# EAGLE design OpenSprinkler_v14_smt (EAGLE 6.2)
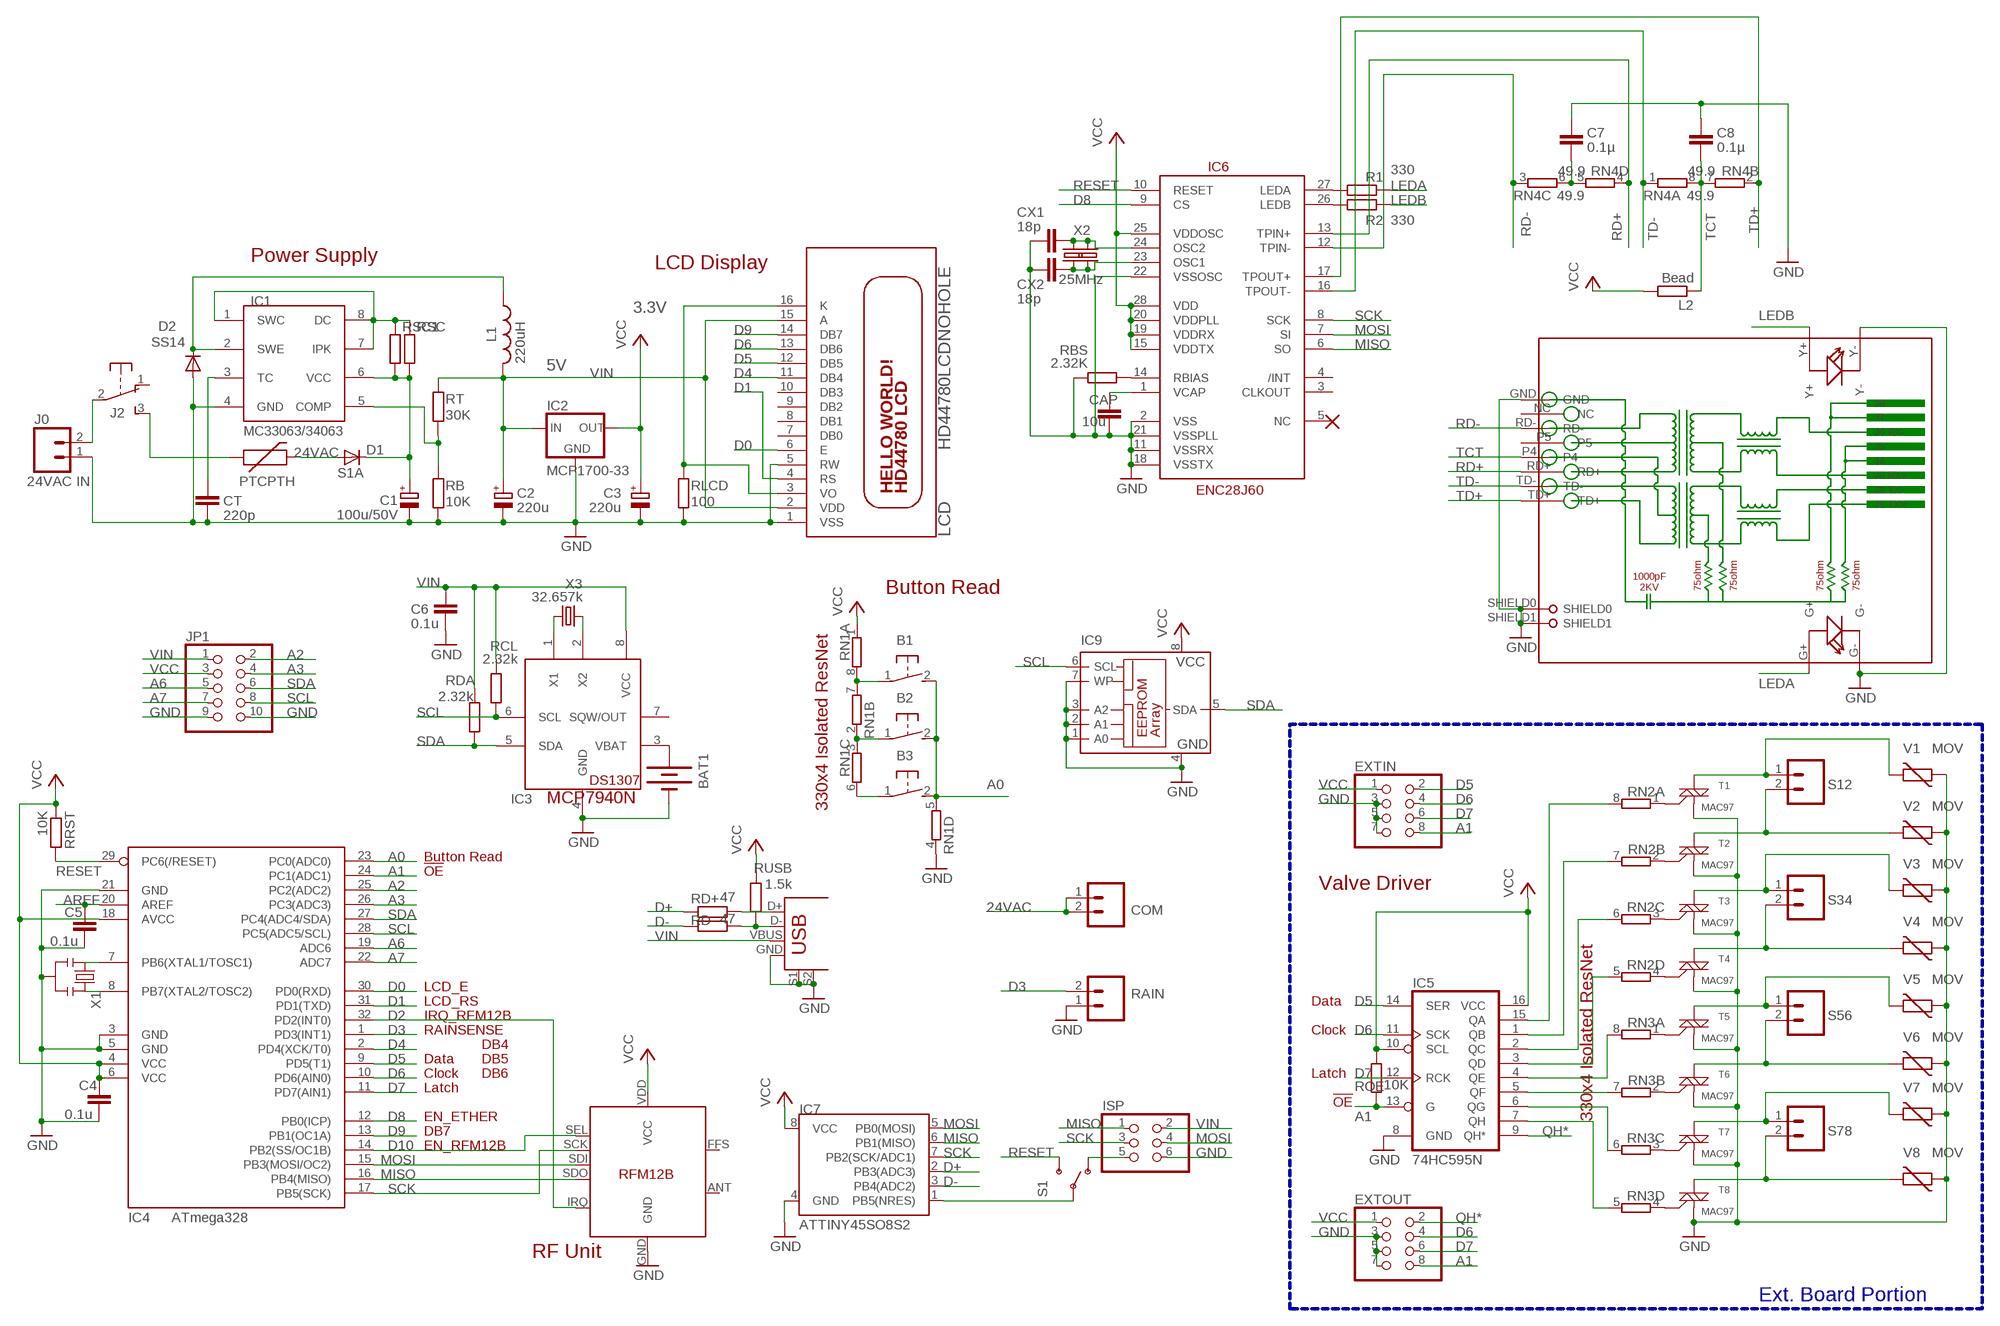
[diagram p0: schematic, sheet 1]

## Parts
B1  31-XX  [B3F-31XX]
B2  31-XX  [B3F-31XX]
B3  31-XX  [B3F-31XX]
BAT1  BATTERY12PTH  [BATTCON_12MM_PTH]
C1  100u/50V  CPOL-EUE3.5-8  [E3,5-8]
C2  220u  CPOL-EUE2-5  [E2-5]
C3  220u  CPOL-EUE2-5  [E2-5]
C4  0.1u  C-EUC0805  [C0805]
C5  0.1u  C-EUC0805  [C0805]
C6  0.1u  C-EUC0805  [C0805]
C7  0.1µ  C-EUC0805  [C0805]
C8  0.1µ  C-EUC0805  [C0805]
CAP  10u  C-EUC0805  [C0805]
COM  M025MM  [SCREWTERMINAL-5MM-2]
CT  220p  C-EUC0805  [C0805]
CX1  18p  C-EUC0805  [C0805]
CX2  18p  C-EUC0805  [C0805]
D1  S1A  DIODE-DO214AC  [DO214AC]
D2  SS14  DIODE-DO214AC  [DO214AC]
EXTIN  PINHD-2X4  [2X04]
EXTOUT  PINHD-2X4  [2X04]
IC1  MC33063/MC34063D  [SO08]
IC2  MCP1700-33  MCP1700SOT233  [SOT23]
IC3  MCP7940N  DS1307SOIC  [SO08]
IC4  ATmega328  MEGA8-AI  [TQFP32-08]
IC5  74HC595N  74LS595D  [SO16]
IC6  ENC28J60  ENC28J60SO28LONG  [SOIC28WLONG]
IC7  ATTINY45SO8S2  [SO8S2]
IC8  RFM12B  [RFM12B]
IC9  24AA128SN  [SO-08]
ISP  PINHD-2X3  [2X03]
J0  24VAC IN  M025MM  [SCREWTERMINAL-5MM-2]
J2  EG1206  [EG1206]
JP1  PINHD-2X5  [2X05]
L1  220uH  L-US6000-XXX-RC  [6000-XXXX-RC]
L2  Bead  R-EU_R0805  [R0805]
LCD  HD44780LCDNOHOLE  [LCD1602A]
PTC  PTCPTH  [PTC]
R1  330  R-EU_R0805  [R0805]
R2  330  R-EU_R0805  [R0805]
RAIN  M025MM  [SCREWTERMINAL-5MM-2]
RB  10K  R-EU_R0805  [R0805]
RBS  2.32K  R-EU_R0805  [R0805]
RCL  2.32k  R-EU_R0805  [R0805]
RD+  47  R-EU_R0805  [R0805]
RD-  47  R-EU_R0805  [R0805]
RDA  2.32k  R-EU_R0805  [R0805]
RJ1  HR911105A  [HR911105A]
RLCD  100  R-EU_R0805  [R0805]
RN1  4R-NEXBV8V  [EXBV8V]
RN2  4R-NEXBV8V  [EXBV8V]
RN3  4R-NEXBV8V  [EXBV8V]
RN4  49.9  4R-NEXBV8V  [EXBV8V]
ROE  10K  R-EU_R0805  [R0805]
RRST  10K  R-EU_R0805  [R0805]
RSC  1.0  R-EU_R0805  [R0805]
RSC1  1.0  R-EU_R0805  [R0805]
RT  30K  R-EU_R0805  [R0805]
RUSB  1.5k  R-EU_R0805  [R0805]
S1  SWITCH-SPSTSMD2  [SWITCH-SPDT-SMD]
S12  M025MM  [SCREWTERMINAL-5MM-2]
S34  M025MM  [SCREWTERMINAL-5MM-2]
S56  M025MM  [SCREWTERMINAL-5MM-2]
S78  M025MM  [SCREWTERMINAL-5MM-2]
T1  MAC97  MAC97SOT223  [SOT223]
T2  MAC97  MAC97SOT223  [SOT223]
T3  MAC97  MAC97SOT223  [SOT223]
T4  MAC97  MAC97SOT223  [SOT223]
T5  MAC97  MAC97SOT223  [SOT223]
T6  MAC97  MAC97SOT223  [SOT223]
T7  MAC97  MAC97SOT223  [SOT223]
T8  MAC97  MAC97SOT223  [SOT223]
USB  USB+SHIELD  [USB-B-PTH]
V1  MOV  VARISTOR-5  [R-5]
V2  MOV  VARISTOR-5  [R-5]
V3  MOV  VARISTOR-5  [R-5]
V4  MOV  VARISTOR-5  [R-5]
V5  MOV  VARISTOR-5  [R-5]
V6  MOV  VARISTOR-5  [R-5]
V7  MOV  VARISTOR-5  [R-5]
V8  MOV  VARISTOR-5  [R-5]
X1  RESONATORSMD  [RESONATOR-SMD]
X2  25MHz  CRYSTALSMD  [HC49UP]
X2A  25MHz  CRYSTALHC49US  [HC49US]
X3  32.657k  CRYSTALTC26H  [TC26H]

## Nets
24VAC [power]: COM.1 COM.2 D1.A PTC.P$2
A0: B1.2(S) B2.2(S) B3.2(S) IC4.23(PC0(ADC0)) RN1.5
A1: EXTIN.8 EXTOUT.8 IC4.24(PC1(ADC1)) IC5.13(G) ROE.1
A2: IC4.25(PC2(ADC2)) JP1.2
A3: IC4.26(PC3(ADC3)) JP1.4
A6: IC4.19(ADC6) JP1.5
A7: IC4.22(ADC7) JP1.7
AREF: C5.1 IC4.20(AREF)
D0: IC4.30(PD0(RXD)) LCD.6(E)
D1: IC4.31(PD1(TXD)) LCD.4(RS)
D2: IC4.32(PD2(INT0)) IC8.IRQ
D3: IC4.1(PD3(INT1)) RAIN.2
D4: IC4.2(PD4(XCK/T0)) LCD.11(DB4)
D5: EXTIN.2 IC4.9(PD5(T1)) IC5.14(SER) LCD.12(DB5)
D6: EXTIN.4 EXTOUT.4 IC4.10(PD6(AIN0)) IC5.11(SCK) LCD.13(DB6)
D7: EXTIN.6 EXTOUT.6 IC4.11(PD7(AIN1)) IC5.12(RCK)
D8: IC4.12(PB0(ICP)) IC6.9(CS)
D9: IC4.13(PB1(OC1A)) LCD.14(DB7)
D10: IC4.14(PB2(SS/OC1B)) IC8.SEL
D+: IC7.2(PB3(ADC3)) RD+.1
D-: IC7.3(PB4(ADC2)) RD-.1
GND: BAT1.GND(-) C1.- C2.- C3.- C4.2 C5.2 C6.2 C7.1 C8.1 CAP.2 CT.2 CX1.2 CX2.2 D2.A EXTIN.3 EXTIN.5 EXTIN.7 EXTOUT.3 EXTOUT.5 EXTOUT.7 IC1.4(GND) IC2.1(GND) IC3.4(GND) IC4.3(GND) IC4.5(GND) IC4.21(GND) IC5.8(GND) IC6.2(VSS) IC6.11(VSSRX) IC6.18(VSSTX) IC6.21(VSSPLL) IC6.22(VSSOSC) IC7.4(GND) IC8.GND IC9.1(A0) IC9.2(A1) IC9.3(A2) IC9.4(GND) IC9.7(WP) ISP.6 J0.1 JP1.9 JP1.10 LCD.1(VSS) LCD.5(RW) RAIN.1 RB.2 RBS.1 RJ1.G- RJ1.GND RJ1.SHIELD0 RJ1.SHIELD1 RJ1.Y- RLCD.2 RN1.4 T1.1(M1) T2.1(M1) T3.1(M1) T4.1(M1) T5.1(M1) T6.1(M1) T7.1(M1) T8.1(M1) USB.GND USB.S1 USB.S2 V1.1 V2.1 V3.1 V4.1 V5.1 V6.1 V7.1 V8.1 X1.2
LEDA: R1.2 RJ1.G+
LEDB: R2.2 RJ1.Y+
MISO: IC4.16(PB4(MISO)) IC6.6(SO) IC7.6(PB1(MISO)) IC8.SDO ISP.1
MOSI: IC4.15(PB3(MOSI/OC2)) IC6.7(SI) IC7.5(PB0(MOSI)) IC8.SDI ISP.4
N$2: IC4.8(PB7(XTAL2/TOSC2)) X1.3
N$3: RN2.1 T1.3(G)
N$4: IC5.5(QF) RN3.7
N$5: IC5.6(QG) RN3.6
N$6 [power]: J0.2 J2.2(P)
N$7: IC5.7(QH) RN3.5
N$8: IC4.7(PB6(XTAL1/TOSC1)) X1.1
N$9 [power]: C1.+ D1.C IC1.6(VCC) RSC1.2 RSC.2
N$10: IC5.4(QE) RN3.8
N$11: IC5.3(QD) RN2.5
N$12: IC5.2(QC) RN2.6
N$13: IC5.1(QB) RN2.7
N$14: IC5.15(QA) RN2.8
N$15: RN2.2 T2.3(G)
N$16 [power]: S12.1 T1.4(M2) V1.2
N$17 [power]: S12.2 T2.4(M2) V2.2
N$18 [power]: S34.1 T3.4(M2) V3.2
N$19: RN2.3 T3.3(G)
N$20 [power]: S34.2 T4.4(M2) V4.2
N$21: RN2.4 T4.3(G)
N$22 [power]: S56.1 T5.4(M2) V5.2
N$23 [power]: S56.2 T6.4(M2) V6.2
N$24 [power]: S78.1 T7.4(M2) V7.2
N$25 [power]: S78.2 T8.4(M2) V8.2
N$26: RN3.1 T5.3(G)
N$27: RN3.2 T6.3(G)
N$28: RN3.3 T7.3(G)
N$29: RN3.4 T8.3(G)
N$30: ISP.5 S1.1(O)
N$31 [power]: J2.3(S) PTC.P$1
N$32: B1.1(P) RN1.7 RN1.8
N$33: B3.1(P) RN1.6
N$34: IC6.27(LEDA) R1.1
N$35: B2.1(P) RN1.2 RN1.3
N$36: BAT1.VCC@1(+) IC3.3(VBAT)
N$37: IC6.26(LEDB) R2.1
N$38: RD+.2 USB.D+
N$39: CAP.1 IC6.1(VCAP)
N$40 [power]: IC1.1(SWC) IC1.7(IPK) IC1.8(DC) RSC1.1 RSC.1
N$41: CX1.1 IC6.24(OSC2) X2.1 X2A.2
N$42: CX2.1 IC6.23(OSC1) X2.2 X2A.1
N$45: RD-.2 RUSB.1 USB.D-
N$46 [power]: D2.C IC1.2(SWE) L1.1
N$47: IC3.1(X1) X3.1
N$49: CT.1 IC1.3(TC)
N$50: IC3.2(X2) X3.2
N$52: IC7.1(PB5(NRES)) S1.2(P)
N$54: C7.2 RN4.5 RN4.6
N$55: IC1.5(COMP) RB.1 RT.2
N$56: LCD.3(VO) LCD.16(K) RLCD.1
N$59: IC6.14(RBIAS) RBS.2
QH*: EXTOUT.2 IC5.9(QH*)
RD+: IC6.13(TPIN+) RJ1.RD+ RN4.4
RD-: IC6.12(TPIN-) RJ1.RD- RN4.3
RESET: IC4.29(PC6(/RESET)) IC6.10(RESET) RRST.2 S1.3(S)
SCK: IC4.17(PB5(SCK)) IC6.8(SCK) IC7.7(PB2(SCK/ADC1)) IC8.SCK ISP.3
SCL: IC3.6(SCL) IC4.28(PC5(ADC5/SCL)) IC9.6(SCL) JP1.8 RCL.2
SDA: IC3.5(SDA) IC4.27(PC4(ADC4/SDA)) IC9.5(SDA) JP1.6 RDA.2
TCT: C8.2 L2.1 RJ1.P4 RN4.7 RN4.8
TD+: IC6.17(TPOUT+) RJ1.TD+ RN4.2
TD-: IC6.16(TPOUT-) RJ1.TD- RN4.1
VCC: C3.+ C4.1 EXTIN.1 EXTOUT.1 IC2.2(OUT) IC4.4(VCC) IC4.6(VCC) IC4.18(AVCC) IC5.10(SCL) IC5.16(VCC) IC6.15(VDDTX) IC6.19(VDDRX) IC6.20(VDDPLL) IC6.25(VDDOSC) IC6.28(VDD) IC7.8(VCC) IC8.VDD(VCC) IC9.8(VCC) JP1.3 L2.2 RN1.1 ROE.2 RRST.1 RUSB.2
VIN: C2.+ C6.1 IC2.3(IN) IC3.8(VCC) ISP.2 JP1.1 L1.2 LCD.2(VDD) LCD.15(A) RCL.1 RDA.1 RT.1 USB.VBUS
Unconnected: IC3.7(SQW/OUT) IC6.3(CLKOUT) IC6.4(/INT) IC6.5(NC) IC8.ANT IC8.FFS J2.1(O) LCD.7(DB0) LCD.8(DB1) LCD.9(DB2) LCD.10(DB3) RJ1.NC RJ1.P5

## Buses
B$1

## Notes on the sheet
- Power Supply
- LCD Display
- 3.3V
- 5V
- Button Read
- MCP7940N
- 330x4 Isolated ResNet
- Button Read
- !OE
- Valve Driver
- LCD_E
- LCD_RS | Data
- IRQ_RFM12B
- RAINSENSE | Clock
- DB4
- Data | DB5
- Clock | DB6 | Latch
- Latch
- !OE
- EN_ETHER | 330x4 Isolated ResNet
- DB7
- EN_RFM12B
- RF Unit
- Ext. Board Portion

## Library data of the parts
B1-B3 = adafruit:31-XX: OMRON SWITCH Now with beefier pads!
BAT1 = SparkFun:BATTERY: Battery Holders Various common sizes : AA, AAA, 20mm coin cell and 12mm coin cell.
C1-C3 = resistor:CPOL-EU: POLARIZED CAPACITOR, European symbol
C4-C6 CT = rcl:C-EU: CAPACITOR, European symbol
C7 C8 CAP CX1 CX2 = resistor:C-EU: CAPACITOR, European symbol
COM J0 RAIN S12 S34 S56 S78 = SparkFun:M02: Header 2 Standard 2-pin 0.1" header. Use with straight break away headers (SKU : PRT-00116), right angle break away headers (PRT-00553), swiss pins (PRT-00743), machine pins (PRT-00117), and female headers (PRT-00115). Molex polarized connector foot print use with SKU : PRT-08233 with associated crimp pins and housings.
D1 D2 = diode:DIODE-: DIODE
EXTIN EXTOUT = pinhead:PINHD-2X4: PIN HEADER
IC1 = adafruit:MC33063/MC34063: MC33063 and MC34063 Basic DC/DC converter with internal power-NPN transistor, 100KHz, 1.5A peak switch current. 3-40 input/output.
IC2 = adafruit:MCP1700: VOLTAGE REGULATOR
IC3 = adafruit:DS1307: DS1307 Real time clock (RTC) with battery backup ability. Talk to it via i2c
IC4 = atmel:MEGA8: MICROCONTROLLER 8 Kbytes FLASH, 1 kbytes SRAM, 512 bytes EEPROM, USART, 6-channel 10 bit ADC, 2-channel 8 bit ADC Pin compatible with Atmega48, ATMega88, ATMega168 Source: avr.lbr; MPN: ATMEGA8-16AU; OC_FARNELL: 9171371; OC_NEWARK: 73M8863
IC5 = SparkFun:74*595: 8-bit SHIFT REGISTER, output latch
IC6 = SparkFun:ENC28J60
IC7 = SparkFun:ATTINY45: Atmel ATTiny45
IC8 = JeeLabs:RFM12B
IC9 = microchip-6:24*: Serial EEPROM I2C
ISP = pinhead:PINHD-2X3: PIN HEADER
J2 = adafruit:EG1206
JP1 = pinhead:PINHD-2X5: PIN HEADER
L1 = rcl:L-US: INDUCTOR, American symbol
L2 R1 R2 RB RBS RCL RD+ RD- RDA RLCD ROE RRST RSC RSC1 RT RUSB = rcl:R-EU_: RESISTOR, European symbol
LCD = adafruit:HD44780LCD: HD44780 LCD Standard character type LCDs, available in sizes from 8x1 to 40x4!
PTC = SparkFunNew:PTC: Resettable Fuse PTC Resettable Fuse. Spark Fun Electronics SKU : COM-08357
RJ1 = CONNECTER:HR911105A
RN1-RN4 = resistor-dil:4R-N: Array Chip Resistor Source: RS Component / Phycomp; OC_FARNELL: unknown; OC_NEWARK: unknown
S1 = SparkFun:SWITCH-SPST: SPST Switch Simple slide switch. Spark Fun Electronics SKU : COM-00102
T1-T8 = SparkFun:MAC97: MAC97 Triac http://www.onsemi.com/pub_link/Collateral/MAC97-D.PDF
USB = SparkFunNew:USB+SHIELD: USB+Shield USB connector with shield pins connectable
V1-V8 = varistor:VARISTOR: VARISTOR
X1 = SparkFun:RESONATOR: Resonator Small SMD resonator. This is the itty bitty 10/20MHz resonators with built in caps. CSTCE10M0G55 and CSTCE20M0V53. Footprint has been reviewed closely but hasn't been tested yet.
X2 X2A = SparkFun:CRYSTAL: Crystals Various standard crystals. Proven footprints. Spark Fun Electronics SKU : COM-00534
X3 = crystal:CRYSTAL: CRYSTAL; OC_FARNELL: unknown; OC_NEWARK: unknown

## Net classes
0 default: width 0.305 mm, clearance 0.203 mm
1 power: width 0.813 mm, clearance 0.203 mm

## Board
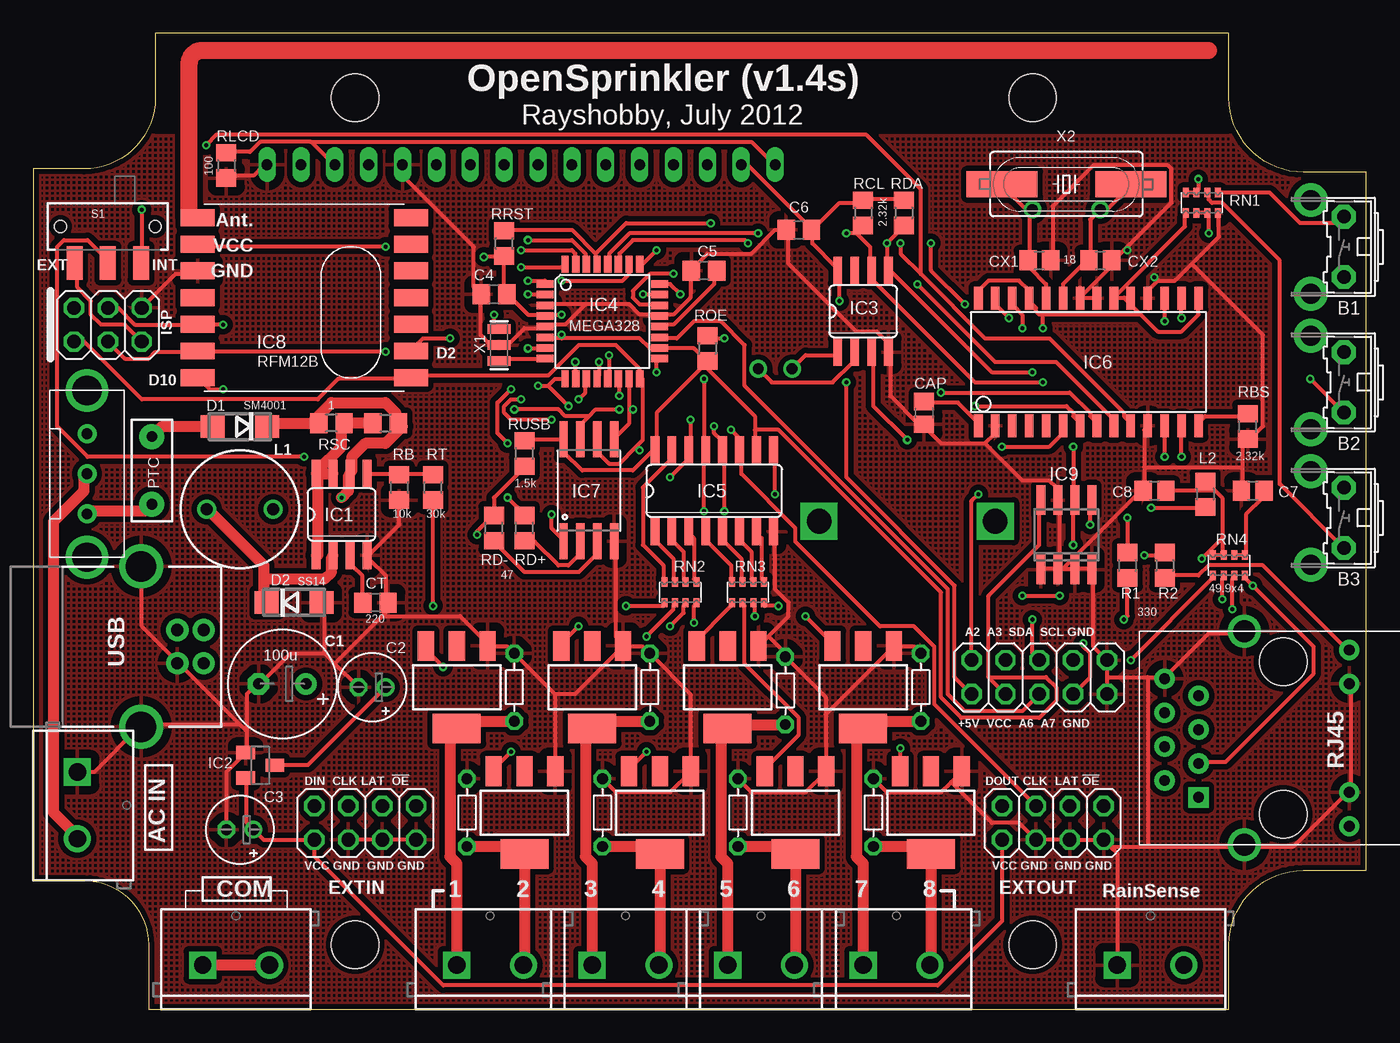
[diagram p1: board, top side]
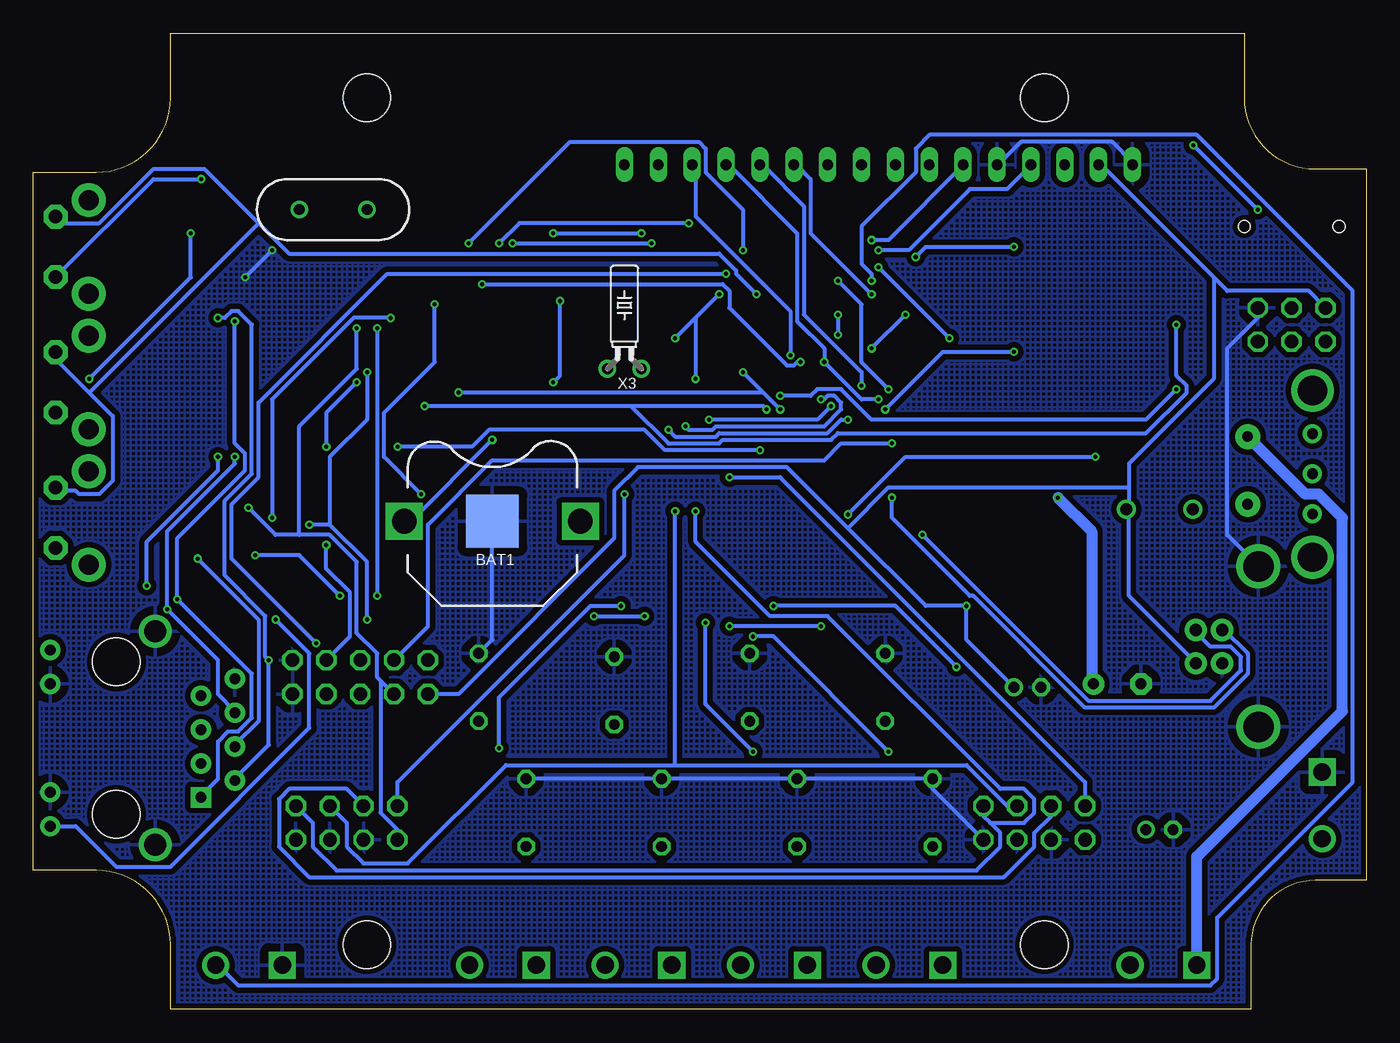
[diagram p2: board, bottom side, seen from below]

Size 99.95 x 73.15 mm. Coordinates in mm from the lower left corner, seen from the top.
Outline: 8.64,0 89.66,0 89.66,4.83 arc-90 95.25,10.41 99.95,10.41 99.95,62.74 95.25,62.74 arc-90 89.66,68.33 89.66,73.15 9.14,73.15 9.14,68.33 arc-90 3.81,62.99 0,62.99 0,9.65 3.81,9.65 arc-90 8.64,4.83 8.64,0
Copper layers (1*16): Top 0.035mm / dielectric 1.5mm / Bottom 0.035mm
Design rules: minimum track width 6mil, minimum drill 12mil, track to track 6mil, track to pad 6mil, pad to pad 8mil, via to via 8mil, smd to smd 0mil, copper to edge 10mil, drill to drill 10mil, minimum pad ring 10mil, minimum via ring 6mil, stop-mask expansion 2mil, vias tented up to drill 100mil, thermal gap 25mil
Holes 3.56 mm at 24.13,4.83 74.93,4.83 24.13,68.33 74.93,68.33
tRestrict: area 9.1,66 to 89.7,73.2
bRestrict: area 9.1,66 to 89.9,73.2
vRestrict: area 21.6,2.3 to 26.7,7.4; area 72.4,2.3 to 77.5,7.4; area 71.9,10.4 to 81.3,10.9; area 71.4,16.8 to 80.8,17.3; area 20.3,16.8 to 29.5,17.3; area 20.3,10.4 to 29.5,10.9; area 8.4,46.5 to 10.9,47.8; area 30,48.5 to 31.8,49.8; area 0.3,55.4 to 2,56.4; area 8.9,55.4 to 10.7,56.1; area 9.7,50.5 to 10.4,52.6; area 8.4,12.2 to 10.4,18; 9 more areas

### Footprints (pad centres in the part's own frame; a part is rotated, then mirrored left to right if it is on the bottom)
B3F-31XX = drill 1.016 pad 1.778 octagon: 1 -2.261,-1.245; 2 2.261,-1.245 | drill 1.499 pad 2.54: 3 -3.505,1.245; 4 3.505,1.245
BATTCON_12MM_PTH = smd 3.962 x 3.962: GND 0,0 | drill 1.854 square: VCC@1 -6.604,0; VCC@2 6.604,0
E3,5-8 = drill 0.813 pad 1.6: + -1.778,0 | drill 0.813 pad 1.6 octagon: - 1.778,0
E2-5 = drill 0.813 pad 1.27: + -1.016,0 | drill 0.813 pad 1.27 octagon: - 1.016,0
C0805 = smd 1.3 x 1.5: 1 -0.95,0; 2 0.95,0
C0805' = smd 1.3 x 1.5: 1 -0.85,0; 2 0.85,0
SCREWTERMINAL-5MM-2 = drill 1.3 pad 2.032 square: 1 0,0 | drill 1.3 pad 2.032: 2 5,0
DO214AC = smd 1.8 x 1.7: A 2.05,0; C -2.05,0
2X04 = drill 1.016 octagon: 1 -3.81,-1.27; 2 -3.81,1.27; 3 -1.27,-1.27; 4 -1.27,1.27; 5 1.27,-1.27; 6 1.27,1.27; 7 3.81,-1.27; 8 3.81,1.27
SO08 = smd 0.66 x 2.032: 1 -1.905,-3.073; 2 -0.635,-3.073; 3 0.635,-3.073; 4 1.905,-3.073; 5 1.905,3.073; 6 0.635,3.073; 7 -0.635,3.073; 8 -1.905,3.073
SOT23 = smd 1 x 1.4: 1 -0.95,-1.1; 2 0.95,-1.1; 3 0,1.1
TQFP32-08 = smd 1.27 x 0.559: 1 -4.293,2.8; 2 -4.293,2; 3 -4.293,1.2; 4 -4.293,0.4; 5 -4.293,-0.4; 6 -4.293,-1.2; 7 -4.293,-2; 8 -4.293,-2.8; 17 4.293,-2.8; 18 4.293,-2; 19 4.293,-1.2; 20 4.293,-0.4; 21 4.293,0.4; 22 4.293,1.2; 23 4.293,2; 24 4.293,2.8 | smd 0.559 x 1.27: 9 -2.8,-4.293; 10 -2,-4.293; 11 -1.2,-4.293; 12 -0.4,-4.293; 13 0.4,-4.293; 14 1.2,-4.293; 15 2,-4.293; 16 2.8,-4.293; 25 2.8,4.293; 26 2,4.293; 27 1.2,4.293; 28 0.4,4.293; 29 -0.4,4.293; 30 -1.2,4.293; 31 -2,4.293; 32 -2.8,4.293
SO16 = smd 0.66 x 2.032: 1 -4.445,-3.073; 2 -3.175,-3.073; 3 -1.905,-3.073; 4 -0.635,-3.073; 5 0.635,-3.073; 6 1.905,-3.073; 7 3.175,-3.073; 8 4.445,-3.073; 9 4.445,3.073; 10 3.175,3.073; 11 1.905,3.073; 12 0.635,3.073; 13 -0.635,3.073; 14 -1.905,3.073; 15 -3.175,3.073; 16 -4.445,3.073
SOIC28WLONG = smd 0.65 x 1.7: 1 -8.89,-4.78; 2 -7.62,-4.78; 3 -6.35,-4.78; 4 -5.08,-4.78; 5 -3.81,-4.78; 6 -2.54,-4.78; 7 -1.27,-4.78; 8 0,-4.78; 9 1.27,-4.78; 10 2.54,-4.78; 11 3.81,-4.78; 12 5.08,-4.78; 13 6.35,-4.78; 14 7.62,-4.78; 15 7.62,4.78; 16 6.35,4.78; 17 5.08,4.78; 18 3.81,4.78; 19 2.54,4.78; 20 1.27,4.78; 21 0,4.78; 22 -1.27,4.78; 23 -2.54,4.78; 24 -3.81,4.78; 25 -5.08,4.78; 26 -6.35,4.78; 27 -7.62,4.78; 28 -8.89,4.78
SO8S2 = smd 0.61 x 2.7: 1 -1.905,-3.778; 2 -0.635,-3.778; 3 0.635,-3.778; 4 1.905,-3.778; 5 1.905,3.853; 6 0.635,3.853; 7 -0.635,3.853; 8 -1.905,3.853
RFM12B = smd 2.54 x 1.27: ANT 8,-6; FFS -8,2; GND 8,-2; IRQ -8,4; P$8 -8,0; P$9 -8,-2; P$10 -8,-4; P$12 -8,-6; P$16 8,0; SCK 8,4; SDI 8,2; SDO -8,6; SEL 8,6; VDD 8,-4
SO-08 = smd 0.66 x 2.2: 1 -1.905,-2.6; 2 -0.635,-2.6; 3 0.635,-2.6; 4 1.905,-2.6; 5 1.905,2.6; 6 0.635,2.6; 7 -0.635,2.6; 8 -1.905,2.6
2X03 = drill 1.016 octagon: 1 -2.54,-1.27; 2 -2.54,1.27; 3 0,-1.27; 4 0,1.27; 5 2.54,-1.27; 6 2.54,1.27
EG1206 = drill 0.8 pad 1.422: 1 -3,0; 2 0,0; 3 3,0 | drill 2.2: MT1 -6.25,0; MT2 6.25,0
2X05 = drill 1.016 octagon: 1 -5.08,-1.27; 2 -5.08,1.27; 3 -2.54,-1.27; 4 -2.54,1.27; 5 0,-1.27; 6 0,1.27; 7 2.54,-1.27; 8 2.54,1.27; 9 5.08,-1.27; 10 5.08,1.27
6000-XXXX-RC = drill 0.9 pad 1.422: 1 -2.5,0; 2 2.5,0
R0805 = smd 1.3 x 1.5: 1 -0.95,0; 2 0.95,0
LCD1602A = drill 0.8 long: 1 8,33.46; 2 10.54,33.46; 3 13.08,33.46; 4 15.62,33.46; 5 18.16,33.46; 6 20.7,33.46; 7 23.24,33.46; 8 25.78,33.46; 9 28.32,33.46; 10 30.86,33.46; 11 33.4,33.46; 12 35.94,33.46; 13 38.48,33.46; 14 41.02,33.46; 15 43.56,33.46; 16 46.1,33.46
PTC = drill 0.8 pad 1.88: P$1 -2.54,0; P$2 2.54,0
HR911105A = drill 0.813 pad 1.524: G+ 4.953,-6.604; G- 4.953,-4.064; GND -8.89,4.445; NC -6.35,3.175; P4 -8.89,-0.635; P5 -6.35,0.635; RD+ -6.35,-1.905; RD- -8.89,1.905; TD- -8.89,-3.175; Y+ 4.953,6.604; Y- 4.953,4.064 | drill 1.651 pad 2.159: SHIELD0 -2.921,8.001; SHIELD1 -2.921,-8.001 | drill 0.813 pad 1.524 square: TD+ -6.35,-4.445 | hole 3.556: 0,-5.715; 0,5.715
EXBV8V = smd 0.45 x 0.7: 1 -1.2,-0.775; 2 -0.4,-0.775; 3 0.4,-0.775; 4 1.2,-0.775; 5 1.2,0.775; 6 0.4,0.775; 7 -0.4,0.775; 8 -1.2,0.775
SWITCH-SPDT-SMD = smd 1.2 x 2.5: 1 -2.5,-2.75; 2 0,-2.75; 3 2.5,-2.75 | hole 0.9: -3.55,0; 3.55,0
SOT223 = smd 1.219 x 2.235: 1 -2.311,-3.099; 2 0,-3.099; 3 2.311,-3.099 | smd 3.6 x 2.2: 4 0,3.099
USB-B-PTH = drill 0.914 pad 1.676: D+ 0,1.25; D- 1.981,1.25; GND 0,-1.25; VBUS 1.981,-1.25 | drill 2.286: S1 -2.718,-6.02; S2 -2.718,6.02
R-5 = drill 0.813 octagon: 1 -2.54,0; 2 2.54,0
RESONATOR-SMD = smd 0.7 x 1.7: 1 -1.2,0; 2 0,0; 3 1.2,0
HC49UP = smd 5.334 x 1.93: 1 -4.826,0; 2 4.826,0
HC49US = drill 0.813: 1 -2.54,0; 2 2.54,0
TC26H = drill 0.813: 1 -1.27,0; 2 1.27,0

### Placement (x,y rotation side)
B1  97.03,57.15 90 top
B2  97.03,46.99 90 top
B3  97.03,36.83 90 top
BAT1  65.53,36.58 0 bottom
C1  18.67,24.38 180 top
C2  25.4,24.13 180 top
C3  15.49,13.46 180 top
C4  34.54,53.59 180 top
C5  50.29,55.37 180 top
C6  57.4,58.42 180 top
C7  0.1µ  [C0805']  91.44,38.86 0 top
C8  0.1µ  [C0805']  84.07,38.86 0 top
CAP  10u  [C0805']  66.8,44.7 270 top
COM  12.7,3.3 0 top
CT  25.65,30.48 0 top
CX1  18p  [C0805']  75.44,56.13 0 top
CX2  18p  [C0805']  80.01,56.13 0 top
D1  15.49,43.69 180 top
D2  19.56,30.48 0 top
EXTIN  24.89,13.97 0 top
EXTOUT  76.45,13.97 0 top
IC1  23.11,37.08 0 top
IC2  17.02,18.29 270 top
IC3  62.23,52.32 0 top
IC4  42.67,51.56 0 top
IC5  51.05,38.86 0 top
IC6  79.76,48.51 0 top
IC7  41.66,38.86 0 top
IC8  20.32,53.34 180 top
IC9  77.47,35.56 0 top
ISP  5.59,51.31 0 top
J0  3.3,17.78 270 top
J2  4.02,40.13 270 top
JP1  75.44,24.89 0 top
L1  15.49,37.47 0 top
L2  87.88,38.61 270 top
LCD  9.53,29.84 0 top
PTC  8.89,40.39 90 top
R1  82.04,33.27 270 top
R2  84.84,33.27 270 top
RAIN  81.28,3.3 0 top
RB  27.43,39.12 270 top
RBS  91.06,43.69 90 top
RCL  62.23,59.69 270 top
RD+  36.83,36.07 90 top
RD-  34.54,36.07 90 top
RDA  65.28,59.69 270 top
RJ1  93.73,20.32 0 top
RLCD  14.48,63.25 270 top
RN1  87.63,60.45 0 top
RN2  48.51,31.24 0 top
RN3  53.59,31.24 0 top
RN4  89.66,33.27 0 top
ROE  50.55,49.53 270 top
RRST  35.31,57.4 90 top
RSC  22.35,43.94 180 top
RSC1  26.42,43.94 0 top
RT  29.97,39.12 90 top
RUSB  36.83,41.66 90 top
S1  5.59,58.67 0 top
S12  31.75,3.3 0 top
S34  41.91,3.3 0 top
S56  52.07,3.3 0 top
S78  62.23,3.3 0 top
T1  31.75,24.13 180 top
T2  36.83,14.73 180 top
T3  41.91,24.13 180 top
T4  46.99,14.73 180 top
T5  52.07,24.13 180 top
T6  57.15,14.73 180 top
T7  62.23,24.13 180 top
T8  67.31,14.73 180 top
USB  10.79,27.18 0 top
V1  36.07,24.13 270 top
V2  32.51,14.73 270 top
V3  46.23,24.13 270 top
V4  42.67,14.73 270 top
V5  56.39,23.88 270 top
V6  52.83,14.73 270 top
V7  66.55,24.13 270 top
V8  62.99,14.73 270 top
X1  34.92,49.78 270 top
X2  77.47,61.85 0 top
X2A  77.47,59.94 0 bottom
X3  55.63,48.01 0 bottom

### Tracks (layer width: path | path; a pad name or v marks a point on that pad's centre or on a via)
24VAC
  Top 0.813: D1.A 9.65,43.69 PTC.P$2 | COM.2 COM.1
  Bottom 0.813: PTC.P$2 4.57,38.61 3.56,38.61 1.78,36.83 1.78,22.35 12.7,11.43 COM.1
A0  (via drill 0.3)
  Top 0.305: B1.2 97.79,58.93 95,58.93 92.71,61.21 88.9,61.21 RN1.5 | v45.72,53.59 46.74,53.59 IC4.23
  Bottom 0.305: 95.76,46.23 98.04,48.51 98.04,49.02 B2.2 | 95.76,46.23 93.98,44.45 93.98,39.62 95,38.61 96.52,38.61 96.77,38.86 98.04,38.86 B3.2 | v45.72,53.59 47.24,55.12 47.24,55.37 48.51,56.64 80.77,56.64 83.06,58.93 | 83.06,58.93 87.12,62.99 90.93,62.99 95,58.93 97.79,58.93 B1.2 | 83.06,58.93 95.76,46.23
A1  (via drill 0.3)
  Top 0.305: v48.51,53.59 47.75,54.36 46.99,54.36 IC4.24 | v51.82,50.29 50.55,50.29 ROE.1 | v50.29,47.24 50.29,42.16 IC5.13 50.29,41.91 v50.29,37.34
  Bottom 0.305: v51.82,50.29 50.29,51.82 | 50.29,51.82 v48.51,53.59 | 50.29,51.82 v50.29,47.24 | EXTIN.8 28.7,14.48 28.19,13.97 | 28.19,13.97 27.43,13.21 27.43,12.19 29.21,10.41 77.22,10.41 78.99,12.19 78.99,13.97 EXTOUT.8 | v50.29,37.34 50.29,35.05 44.7,29.46 40.39,29.46 27.43,16.51 25.65,16.51 24.89,15.75 24.89,14.73 25.65,13.97 28.19,13.97
A2  (via drill 0.3)
  Top 0.305: v46.74,56.9 45.72,55.88 IC4.25 | v67.31,57.4 67.31,55.37 v69.85,52.83 | v70.87,38.61 70.36,38.1 JP1.2
  Bottom 0.305: v46.74,56.9 46.74,59.94 49.53,62.74 49.53,64.52 50.04,65.02 59.69,65.02 v67.31,57.4 | v69.85,52.83 69.85,48.51 73.66,44.7 73.66,41.4 v70.87,38.61
A3  (via drill 0.3)
  Top 0.305: v39.62,54.61 44.2,54.61 44.7,55.12 44.7,55.63 IC4.26 | v35.81,46.48 34.8,45.47 34.8,43.18 v35.56,42.42
  Bottom 0.305: v39.62,54.61 37.85,52.83 37.85,48.51 v35.81,46.48 | v35.56,42.42 39.37,42.42 40.64,41.15 65.53,41.15 70.36,36.32 70.36,28.7 JP1.4
A6
  Top 0.305: JP1.5 74.17,22.35 69.85,22.35 68.58,23.62 68.58,31.5 53.34,46.74 53.34,49.78 51.56,51.56 49.53,51.56 48.26,50.29 46.99,50.29 IC4.19
A7  (via drill 0.3)
  Top 0.305: v48.01,55.12 46.23,55.12 44.96,53.85 44.96,53.34 45.47,52.83 46.74,52.83 IC4.22 | v78.74,27.43 78.74,27.18 79.25,26.67 79.25,24.89 JP1.7
  Bottom 0.305: v48.01,55.12 73.41,55.12 83.06,45.47 83.06,39.88 85.09,37.85 85.09,33.78 v78.74,27.43
AREF
  Top 0.305: IC4.20 46.99,51.31 48.01,51.31 51.05,54.36 51.05,55.37 C5.1
D0  (via drill 0.3)
  Top 0.305: v37.08,57.66 40.39,57.66 41.4,56.64 41.4,55.88 IC4.30
  Bottom 0.305: v37.08,57.66 35.81,57.66 30.23,63.25 LCD.6
D1  (via drill 0.3)
  Top 0.305: v36.58,56.9 40.39,56.9 40.64,56.64 40.64,55.88 IC4.31
  Bottom 0.305: v36.58,56.9 34.29,56.9 29.72,61.47 26.92,61.47 25.15,63.25 LCD.4
D2  (via drill 0.3)
  Top 0.305: v36.58,55.63 39.62,55.63 IC4.32 | v31.24,50.29 29.21,50.29 28.45,49.53 IC8.IRQ
  Bottom 0.305: v31.24,50.29 v36.58,55.63
D3  (via drill 0.3)
  Top 0.305: v37.08,54.61 38.35,54.61 IC4.1
  Bottom 0.305: v37.08,54.61 37.08,55.12 37.85,55.88 37.85,58.67 33.78,62.74 33.78,64.52 32.77,65.53 12.7,65.53 1.02,53.85 1.02,17.02 11.18,6.86 11.18,2.29 11.68,1.78 84.58,1.78 86.11,3.3 RAIN.2
D4  (via drill 0.3)
  Top 0.305: v37.08,53.59 38.35,53.59 IC4.2
  Bottom 0.305: v37.08,53.59 41.66,58.17 41.66,62.23 42.67,63.25 LCD.11
D5  (via drill 0.3)
  Top 0.305: 38.61,46.74 39.12,47.24 39.62,47.24 IC4.9 | v37.85,46.74 38.61,46.74 | v49.28,44.2 49.28,42.16 IC5.14 49.02,41.91 49.02,41.15 v47.75,39.88 | 38.61,46.74 v40.13,45.21
  Bottom 0.305: v37.85,46.74 37.85,47.75 42.16,52.07 42.16,60.2 45.21,63.25 LCD.12 | v49.28,44.2 41.15,44.2 v40.13,45.21 | EXTIN.2 21.08,17.02 43.94,39.88 v47.75,39.88
D6  (via drill 0.3)
  Top 0.305: v40.64,48.51 40.64,47.5 IC4.10 | EXTOUT.4 67.56,22.86 67.56,27.18 66.04,28.7 63.5,28.7 57.15,35.05 57.15,36.07 53.09,40.13 53.09,41.91 IC5.11 52.83,42.16 52.83,42.93 v52.32,43.43 | v36.58,45.72 35.81,45.72 35.31,45.21 35.31,44.7 35.81,44.2 v38.86,44.2
  Bottom 0.305: LCD.13 47.75,63.25 42.67,58.17 42.67,51.56 40.64,49.53 v40.64,48.51 37.85,45.72 v36.58,45.72 | EXTIN.4 23.62,14.48 24.89,13.21 24.89,12.19 27.18,9.91 79.25,9.91 81.53,12.19 81.53,15.75 80.77,16.51 76.45,16.51 EXTOUT.4 | v38.86,44.2 39.37,44.2 40.39,43.18 48.51,43.18 48.77,42.93 51.82,42.93 v52.32,43.43
D7  (via drill 0.3)
  Top 0.305: v40.89,45.72 41.4,46.23 41.4,47.24 IC4.11 | v51.05,43.69 51.05,43.18 51.56,42.67 51.56,42.16 IC5.12 51.82,41.91 v51.82,37.34
  Bottom 0.305: v40.89,45.72 40.64,45.72 40.39,45.97 39.88,45.97 39.37,45.47 39.37,44.96 40.64,43.69 48.77,43.69 49.02,43.43 50.8,43.43 v51.05,43.69 | EXTIN.6 26.92,15.24 29.97,18.29 51.82,18.29 | 51.82,18.29 64.52,18.29 71.88,10.92 75.18,10.92 76.45,12.19 76.45,13.97 EXTOUT.6 | 51.82,18.29 v51.82,37.34
D8  (via drill 0.3)
  Top 0.305: v42.42,48.51 42.42,47.5 IC4.12 | v66.29,54.36 72.14,48.51 76.71,48.51 81.03,44.2 IC6.9
  Bottom 0.305: v42.42,48.51 42.67,48.51 42.93,48.26 43.43,48.26 47.75,52.58 47.75,53.85 48.26,54.36 v66.29,54.36
D9  (via drill 0.3)
  Top 0.305: v43.18,49.02 43.18,47.5 IC4.13
  Bottom 0.305: v43.18,49.02 43.18,52.32 50.29,59.44 50.29,63.25 LCD.14
D10  (via drill 0.3)
  Top 0.305: v43.94,45.97 43.94,47.24 IC4.14 | v14.22,46.48 13.21,46.48 12.45,47.24 IC8.SEL
  Bottom 0.305: v43.94,45.97 41.66,45.97 41.15,46.48 39.37,46.48 37.08,44.2 16.51,44.2 v14.22,46.48
D+
  Top 0.305: RD+.1 36.83,35.05 37.59,35.05 39.37,33.27 40.13,33.27 40.89,34.04 40.89,35.05 IC7.2
D-
  Top 0.305: RD-.1 34.54,35.05 36.83,32.77 40.89,32.77 42.16,34.04 42.16,35.05 IC7.3
GND  (via drill 0.3)
  Top 0.305: 55.12,27.94 54.61,27.43 T5.1 | 55.12,27.94 56.64,29.46 56.64,30.48 55.63,31.5 55.63,35.56 IC5.8 | V7.1 66.04,27.18 64.77,27.18 T7.1 64.52,27.18 59.44,22.1 | 59.44,22.1 59.44,23.37 V5.1 56.39,26.67 55.12,27.94 | 59.44,22.1 59.44,18.03 T6.1 59.44,17.78 57.91,16.26 53.85,16.26 V6.1 | 68.83,17.02 68.07,16.26 64.01,16.26 V8.1 | 68.83,17.02 69.6,17.78 T8.1 | EXTIN.3 EXTIN.5 EXTIN.7 | ISP.6 10.67,55.12 12.19,55.12 IC8.GND | 39.12,23.62 39.12,18.03 T2.1 | 39.12,23.62 V1.1 35.56,27.18 34.29,27.18 T1.1 34.04,27.43 32,29.46 26.16,29.46 | T3.1 44.45,27.18 45.72,27.18 V3.1 49.28,23.62 49.28,18.03 T4.1 49.28,17.78 47.75,16.26 43.69,16.26 V4.1 | IC7.4 43.69,35.05 43.69,27.94 44.2,27.43 T3.1 | 39.12,23.62 40.64,23.62 44.2,27.18 T3.1 | 26.42,30.48 26.42,32.51 25.15,33.78 IC1.4 25.15,34.04 27.43,36.32 RB.2 | 21.84,26.67 21.84,30.48 D2.A | C2.- 22.61,25.91 | 22.61,25.91 21.84,26.67 | 26.42,30.48 26.42,29.72 26.16,29.46 | 22.61,25.91 26.16,29.46 | 26.42,30.48 CT.2 | J0.1 4.57,17.78 7.87,21.08 USB.S1 8.13,21.34 15.49,21.34 | 16,20.83 16,23.62 16.76,24.38 C1.- 17.02,24.38 19.3,26.67 21.84,26.67 | 16,20.83 16,19.3 IC2.1 15.75,19.05 14.48,17.78 C3.- | 16,20.83 15.49,21.34 | 15.49,21.34 10.92,25.91 USB.GND 10.67,26.16 8.13,28.7 8.13,33.02 USB.S2 | RLCD.2 14.48,62.48 16.51,62.48 17.27,63.25 LCD.1 | 33.53,53.59 33.53,50.55 34.29,49.78 X1.2 35.56,49.78 36.83,51.05 38.35,51.05 IC4.5 38.61,51.31 39.88,51.31 41.4,52.83 | 49.28,55.37 49.28,53.34 48.01,52.07 46.99,52.07 IC4.21 46.74,52.07 45.47,52.07 44.7,52.83 41.4,52.83 | 41.4,52.83 38.61,52.83 IC4.3 | 49.28,55.37 50.55,56.64 53.85,56.64 55.63,58.42 C6.2 56.64,58.42 56.64,55.88 61.72,50.8 63.25,50.8 64.01,50.04 64.01,49.28 IC3.4 64.26,49.02 64.26,45.97 66.29,43.94 66.8,43.94 CAP.2 66.8,43.69 68.07,42.42 71.37,42.42
  Top 0.305: 49.28,55.37 C5.2 | 33.53,53.59 33.02,54.1 33.02,57.15 27.69,62.48 27.69,63.25 LCD.5 | 33.53,53.59 C4.2 | RJ1.Y- 98.81,24.38 98.81,16.26 RJ1.G- 98.55,16.26 94.49,12.19 90.93,12.19 RJ1.SHIELD1 90.68,12.19 83.57,12.19 | RAIN.1 81.28,11.68 80.77,12.19 | 80.77,12.19 83.57,12.19 | 80.77,12.19 EXTOUT.7 EXTOUT.5 EXTOUT.3 73.91,13.97 71.88,13.97 68.83,17.02 | 78.49,53.34 78.49,54.1 | 78.49,53.34 80.77,55.63 80.77,56.13 CX2.2 81.03,56.13 82.04,57.15 | 78.49,53.34 79.76,53.34 IC6.21 | 78.49,53.34 IC6.22 | IC6.2 72.14,43.18 71.37,42.42 | 90.68,40.64 90.68,42.42 90.93,42.67 RBS.1 91.19,42.67 92.2,43.69 92.2,50.55 86.87,55.88 | 90.68,40.64 90.68,38.86 C7.1 | 83.31,40.64 83.31,43.43 83.57,43.69 IC6.11 | 83.31,40.64 83.31,38.86 C8.1 83.06,38.86 77.22,33.02 | 83.31,40.64 90.68,40.64 | IC9.1 75.69,33.02 76.71,33.02 IC9.2 76.96,33.02 | 76.96,33.02 76.96,38.1 IC9.7 76.71,38.35 76.71,39.12 76.2,39.62 74.17,39.62 71.37,42.42 | 76.96,33.02 77.22,33.02 | 77.22,33.02 77.98,33.02 IC9.3 78.23,33.02 79.25,33.02 IC9.4 79.5,32.77 79.5,27.18 JP1.10 80.52,24.89 | 80.52,24.89 JP1.9 | 80.52,24.89 83.57,24.89 | 83.57,24.89 84.84,24.89 | 84.84,24.89 88.14,28.19 90.68,28.19 RJ1.SHIELD0 | 84.84,24.89 RJ1.GND | 83.57,24.89 83.57,12.19 | 82.04,57.15 85.34,60.45 85.34,62.99 85.09,63.25 79.5,63.25 76.45,60.2 76.45,56.13 CX1.2 | 86.87,55.88 85.6,54.61 84.33,54.61 | 86.87,55.88 88.9,57.91 88.9,59.44 RN1.4 | 84.33,54.61 83.57,53.85 IC6.18 | v82.04,56.9 82.04,57.15 | 84.33,54.61 v84.07,54.86
  Bottom 0.305: BAT1.GND 65.53,27.69 V7.1 | EXTIN.7 32.51,16.51 V2.1 V4.1 V6.1 V8.1 | ISP.6 8.13,51.82 10.41,49.53 10.41,35.56 8.13,33.27 USB.S2 | LCD.5 27.43,63.5 25.91,65.02 19.05,65.02 17.53,63.5 LCD.1 | v84.07,54.86 v82.04,56.9
  pour Top (isolate 0.406, hatched): 0,73.66 100.33,73.66 100.33,0 0,0
  pour Bottom (isolate 0.406, hatched): 0,73.66 100.33,73.66 100.33,0 0,0
LEDA  (via drill 0.3)
  Top 0.305: R1.2 82.04,29.46 v81.79,29.21
  Bottom 0.305: v81.79,29.21 79.25,26.67 79.25,21.08 89.66,10.67 93.73,10.67 96.77,13.72 RJ1.G+
LEDB
  Top 0.305: R2.2 84.84,32.51 87.38,32.51 88.14,33.27 92.2,33.27 98.55,26.92 RJ1.Y+
MISO  (via drill 0.3)
  Top 0.305: 45.21,42.16 43.94,40.89 43.18,40.89 42.42,41.66 42.42,42.67 IC7.6 | 45.21,42.16 45.72,42.67 45.72,47.24 IC4.16 45.47,47.5 45.47,48.01 43.69,49.78 40.89,49.78 38.61,47.5 28.45,47.5 IC8.SDO 28.19,47.24 22.86,47.24 21.34,45.72 8.13,45.72 3.81,50.04 ISP.1 | IC6.6 77.22,43.18 76.2,42.16 v72.64,42.16 | 45.21,42.16 v45.47,41.91
  Bottom 0.305: v72.64,42.16 67.06,42.16 65.79,43.43 54.1,43.43 52.58,41.91 v45.47,41.91
MOSI  (via drill 0.3)
  Top 0.305: ISP.4 6.35,52.58 7.62,51.31 12.19,51.31 IC8.SDI 12.45,51.31 v14.22,51.31 | 44.7,44.96 44.7,43.94 43.69,42.93 IC7.5 | 44.7,44.96 44.7,47.24 IC4.15 | v70.61,45.21 77.47,45.21 77.98,44.7 77.98,44.45 78.49,43.94 IC6.7 | 44.7,44.96 v44.96,44.96
  Bottom 0.305: 55.12,45.21 45.21,45.21 v44.96,44.96 | 55.12,45.21 v70.61,45.21 | v14.22,51.31 14.22,47.5 13.46,46.74 13.46,46.23 16.51,43.18 39.62,43.18 40.13,42.67 48.26,42.67 48.51,42.42 52.32,42.42 55.12,45.21
N$1
  Top 1.27: 88.14,71.88 12.7,71.88 arc90 11.68,70.87 11.68,59.44
N$2
  Top 0.305: IC4.8 38.35,48.77 35.05,48.77 X1.3
N$3  (via drill 0.3)
  Top 0.305: v44.45,30.23 47.24,30.23 RN2.1 | v30.73,25.65 29.21,27.18 T1.3
  Bottom 0.305: v44.45,30.23 35.31,30.23 v30.73,25.65
N$4
  Top 0.305: RN3.7 53.09,32.26 53.09,33.78 51.82,35.05 51.82,35.56 IC5.5
N$5
  Top 0.305: RN3.6 53.85,32.26 53.85,34.29 53.09,35.05 53.09,35.56 IC5.6
N$6
  Top 0.813: J2.2 3.81,40.13 3.81,38.86 1.52,36.58 1.52,14.73 3.3,12.95 J0.2
N$7
  Top 0.305: RN3.5 54.61,32.26 54.61,35.31 54.36,35.56 IC5.7
N$8  (via drill 0.3)
  Top 0.305: v37.08,49.53 38.35,49.53 IC4.7 | v34.54,52.07 34.54,51.31 34.8,51.05 X1.1
  Bottom 0.305: v34.54,52.07 v37.08,49.53
N$9  (via drill 0.3)
  Top 0.813: 18.03,43.94 17.78,43.69 D1.C 18.29,43.94 RSC.2 21.08,44.2 22.35,45.47 26.42,45.47 27.18,44.7 27.18,43.94 RSC1.2 27.69,43.69 26.42,42.42 24.89,42.42 23.88,41.4 23.88,40.39 IC1.6 23.62,39.88 23.62,38.86 v23.11,38.35
  Bottom 0.813: v23.11,38.35 20.57,35.81 20.57,24.38 C1.+
N$10
  Top 0.305: RN3.8 52.32,32.26 52.32,33.27 50.55,35.05 50.55,35.56 IC5.4
N$11
  Top 0.305: RN2.5 49.53,32.26 49.53,35.31 49.28,35.56 IC5.3
N$12
  Top 0.305: RN2.6 48.77,32.26 48.77,34.29 48.01,35.05 48.01,35.56 IC5.2
N$13
  Top 0.305: RN2.7 48.01,32.26 48.01,33.78 46.74,35.05 46.74,35.56 IC5.1
N$14
  Top 0.305: RN2.8 47.24,32.26 47.24,33.27 45.72,34.8 45.72,39.12 47.75,41.15 47.75,41.91 IC5.15
N$15  (via drill 0.3)
  Top 0.305: v45.97,27.94 48.01,29.97 48.01,30.23 RN2.2 | v35.81,19.3 34.54,18.03 T2.3
  Bottom 0.305: v45.97,27.94 44.45,27.94 v35.81,19.3
N$16
  Top 0.813: V1.2 32.26,21.59 31.75,21.08 T1.4 31.5,20.83 31.24,20.57 31.24,11.43 31.75,10.92 S12.1
N$17
  Top 0.813: V2.2 36.32,12.19 36.83,11.68 T2.4 36.83,3.3 S12.2
N$18
  Top 0.813: V3.2 42.42,21.59 41.91,21.08 T3.4 41.66,20.83 41.4,20.57 41.4,11.43 41.91,10.92 S34.1
N$19  (via drill 0.3)
  Top 0.305: v47.75,28.7 48.77,29.72 48.77,30.23 RN2.3 | v40.89,28.7 39.62,27.43 T3.3
  Bottom 0.305: v40.89,28.7 v47.75,28.7
N$20
  Top 0.813: V4.2 46.48,12.19 46.99,11.68 T4.4 46.99,3.3 S34.2
N$21  (via drill 0.3)
  Top 0.305: v49.53,28.96 49.53,30.23 RN2.4 | v45.97,19.3 44.7,18.03 T4.3
  Bottom 0.305: v49.53,28.96 49.53,22.86 v45.97,19.3
N$22
  Top 0.813: V5.2 52.32,21.34 52.07,21.08 T5.4 51.82,20.83 51.56,20.57 51.56,11.43 52.07,10.92 S56.1
N$23
  Top 0.813: V6.2 56.64,12.19 57.15,11.68 T6.4 57.15,3.3 S56.2
N$24
  Top 0.813: V7.2 62.74,21.59 62.23,21.08 T7.4 61.98,20.83 61.72,20.57 61.72,11.43 62.23,10.92 S78.1
N$25
  Top 0.813: V8.2 66.8,12.19 67.31,11.68 T8.4 67.31,3.3 S78.2
N$26
  Top 0.305: RN3.1 52.32,30.23 49.53,27.43 T5.3
N$27
  Top 0.305: RN3.2 53.34,30.23 53.34,25.91 57.4,21.84 57.4,20.57 54.86,18.03 T6.3
N$28  (via drill 0.3)
  Top 0.305: v54.1,29.46 54.1,30.23 RN3.3 | v57.91,29.46 59.94,27.43 T7.3
  Bottom 0.305: v57.91,29.46 v54.1,29.46
N$29  (via drill 0.3)
  Top 0.305: v55.88,30.23 54.86,30.23 RN3.4 | v65.02,19.56 65.02,18.03 T8.3
  Bottom 0.305: v55.88,30.23 58.17,30.23 65.02,23.37 v65.02,19.56
N$30
  Top 0.305: ISP.5 6.86,51.31 5.08,51.31 4.32,52.07 4.32,53.09 3.3,54.1 3.3,55.88 S1.1
N$31
  Top 0.813: PTC.P$1 8.38,37.34 4.06,37.34 J2.3
N$32  (via drill 0.3)
  Top 0.305: RN1.8 86.61,61.21 87.12,61.21 RN1.7 87.38,61.47 v87.38,62.23
  Bottom 0.305: v87.38,62.23 90.93,62.23 B1.1
N$33
  Top 0.305: B3.1 93.47,39.37 93.47,56.13 89.15,60.45 88.39,60.45 88.14,60.71 88.14,61.21 RN1.6
N$34  (via drill 0.3)
  Top 0.305: v82.04,36.83 R1.1 | v73.15,51.82 72.14,52.83 IC6.27
  Bottom 0.305: v82.04,36.83 82.04,45.72 75.95,51.82 v73.15,51.82
N$35  (via drill 0.3)
  Top 0.305: RN1.2 87.38,59.69 87.88,59.69 RN1.3 88.14,59.44 v88.14,58.17 | B2.1 v95.76,47.24
  Bottom 0.305: v88.14,58.17 88.14,54.86 v95.76,47.24
N$36  (via drill 0.3)
  Top 0.305: v65.53,42.67 62.99,45.21 62.99,49.02 IC3.3
  Bottom 0.305: v65.53,42.67 71.63,36.58 BAT1.VCC@1
N$37  (via drill 0.3)
  Top 0.305: v83.31,34.04 84.84,34.04 R2.1 | v74.17,30.99 v76.96,30.99 | v74.17,51.05 74.17,52.07 73.41,52.83 IC6.26
  Bottom 0.305: v83.31,34.04 80.01,34.04 v76.96,30.99 | v74.17,51.05 v74.17,30.99
N$38  (via drill 0.3)
  Top 0.305: v35.56,38.35 36.83,37.08 RD+.2
  Bottom 0.305: v35.56,38.35 35.56,36.83 29.72,30.99 29.46,30.99 21.08,22.61 11.43,22.61 8.89,25.15 8.89,26.67 10.67,28.45 USB.D+
N$39
  Top 0.305: CAP.1 66.8,45.47 69.34,45.47 70.87,43.94 IC6.1
N$40
  Top 0.813: RSC1.1 RSC.1 23.11,43.69 23.11,42.16 21.34,40.39 IC1.8 21.34,40.13 | 21.34,40.13 21.34,34.04 IC1.1 | 21.34,40.13 22.35,40.13 IC1.7
N$41
  Top 0.305: 74.68,59.69 74.68,56.13 | IC6.24 75.95,54.36 74.68,55.63 74.68,56.13 | 74.68,56.13 CX1.1 | 74.68,59.69 72.64,61.72 X2.1 | 74.68,59.69 X2A.2
N$42
  Top 0.305: X2.2 82.3,61.72 80.52,59.94 X2A.1 79.25,59.18 79.25,56.13 CX2.1 78.99,56.13 77.22,54.36 IC6.23
N$45  (via drill 0.3)
  Top 0.305: 34.54,37.08 34.54,38.35 36.83,40.64 RUSB.1 | v33.27,35.56 33.27,35.81 34.54,37.08 | 34.54,37.08 RD-.2
  Bottom 0.305: v33.27,35.56 20.83,23.11 11.68,23.11 9.4,25.4 9.4,26.42 10.16,27.18 11.68,27.18 12.7,28.19 USB.D-
N$46
  Top 0.813: 17.27,32.26 17.27,33.27 13.21,37.34 L1.1 | 17.27,32.26 17.27,30.48 D2.C | 17.27,32.26 21.84,32.26 22.35,32.77 22.35,33.78 IC1.2
N$47
  Top 0.305: X3.1 57.91,49.02 60.2,49.02 IC3.1
N$49
  Top 0.305: CT.1 24.64,30.48 24.64,32.51 23.88,33.27 23.88,33.78 IC1.3
N$50
  Top 0.305: X3.2 55.37,46.99 59.94,46.99 61.47,48.51 61.47,49.02 IC3.2
N$52  (via drill 0.3)
  Top 0.305: v20.32,41.4 4.06,41.4 1.78,43.69 1.78,57.15 2.29,57.66 4.06,57.66 5.59,56.13 S1.2 | v38.86,37.08 38.86,36.07 39.62,35.31 IC7.1
  Bottom 0.305: v20.32,41.4 34.54,41.4 v38.86,37.08
N$54
  Top 0.305: RN4.6 90.17,34.04 90.68,34.04 RN4.5 90.93,34.29 90.93,37.08 92.2,38.35 92.2,38.86 C7.2
N$55
  Top 0.305: 27.43,40.13 25.15,40.13 IC1.5 | 27.43,40.13 29.97,40.13 RT.2 | 27.43,40.13 RB.1
N$56
  Top 0.305: 20.83,65.02 17.02,65.02 16.26,64.26 14.48,64.26 RLCD.1 | 20.83,65.02 22.35,63.5 LCD.3 | 20.83,65.02 53.85,65.02 55.37,63.5 LCD.16
N$59
  Top 0.305: RBS.2 90.93,44.45 87.88,44.45 87.38,43.94 IC6.14
QH*  (via drill 0.3)
  Top 0.305: v55.63,38.61 55.63,41.91 IC5.9
  Bottom 0.305: v55.63,38.61 55.63,34.04 72.64,17.02 EXTOUT.2
RD+  (via drill 0.3)
  Top 0.305: RN4.4 90.93,32.26 v91.44,31.75 96.01,27.18 96.01,25.15 89.41,18.54 87.38,18.54 RJ1.RD+ | v86.11,41.4 IC6.13
  Bottom 0.305: v86.11,41.4 86.11,40.39 91.44,35.05 v91.44,31.75
RD-  (via drill 0.3)
  Top 0.305: v89.92,29.97 89.92,32.26 RN4.3 | v84.84,41.4 IC6.12
  Bottom 0.305: RJ1.RD- 84.84,22.35 86.11,23.62 86.11,26.16 v89.92,29.97 89.92,35.81 84.84,40.89 v84.84,41.4
RESET  (via drill 0.3)
  Top 0.305: 42.16,56.64 42.16,55.88 IC4.29 | 42.16,56.64 40.39,58.42 35.31,58.42 RRST.2 | 66.55,55.12 65.02,56.64 v65.02,57.4 | 66.55,55.12 71.37,50.29 76.2,50.29 81.79,44.7 81.79,44.45 82.3,43.94 IC6.10 | v50.8,58.93 44.45,58.93 42.16,56.64 | v8.13,59.94 8.13,56.13 S1.3 | v12.95,64.77 13.72,65.53 62.48,65.53 66.55,61.47 66.55,55.12
  Bottom 0.305: v65.02,57.4 63.5,58.93 v50.8,58.93 | v12.95,64.77 v8.13,59.94
SCK  (via drill 0.3)
  Top 0.305: ISP.3 6.86,48.77 8.64,48.77 9.14,49.28 12.19,49.28 IC8.SCK 12.45,49.28 v26.42,49.28 | v46.74,47.75 46.74,48.51 IC4.17 | v43.94,44.96 42.16,44.96 41.66,44.45 | 41.66,44.45 41.15,43.94 41.15,42.93 IC7.7 | v68.07,46.23 77.72,46.23 79.25,44.7 79.25,44.45 79.76,43.94 IC6.8 | v36.07,44.96 39.37,44.96 39.88,44.45 41.66,44.45
  Bottom 0.305: v43.94,44.96 45.21,46.23 | 45.21,46.23 v46.74,47.75 | 45.21,46.23 v68.07,46.23 | v26.42,49.28 31.75,49.28 v36.07,44.96
SCL  (via drill 0.3)
  Top 0.305: v77.98,34.8 77.98,38.1 IC9.6 77.98,38.35 v77.98,42.16 | v54.36,58.17 44.7,58.17 43.18,56.64 43.18,55.88 IC4.28 | 61.72,58.17 v60.96,58.17 | 61.72,58.17 62.23,58.67 RCL.2 61.72,58.17 | 61.72,58.17 62.74,57.15 62.74,55.63 IC3.6 62.99,55.37 62.99,54.61 70.61,46.99 v75.69,46.99
  Bottom 0.305: v77.98,34.8 77.98,33.02 76.2,31.24 76.2,27.94 JP1.8 | v60.96,58.17 v54.36,58.17 | v77.98,42.16 77.98,44.7 v75.69,46.99
SDA  (via drill 0.3)
  Top 0.305: v79.25,36.32 79.25,38.1 IC9.5 | v74.93,29.21 74.93,26.67 JP1.6 | v53.59,57.4 53.34,57.66 44.96,57.66 43.94,56.64 43.94,55.88 IC4.27 | RDA.2 65.28,58.67 v64.01,57.4 64.01,55.63 IC3.5 64.26,55.37 71.88,47.75 v74.93,47.75
  Bottom 0.305: 77.72,36.32 v79.25,36.32 | 77.72,36.32 74.93,33.53 v74.93,29.21 | v64.01,57.4 v53.59,57.4 | 77.72,36.32 77.72,41.4 74.93,44.2 v74.93,47.75
TCT  (via drill 0.3)
  Top 0.305: RN4.8 88.65,34.04 89.15,34.04 RN4.7 89.15,34.29 89.15,35.31 | 89.15,35.31 89.15,38.35 88.65,38.86 | 88.65,38.86 87.88,39.62 L2.1 | 88.65,38.86 C8.2 | 89.15,35.31 v87.63,33.78
  Bottom 0.305: v87.63,33.78 83.06,29.21 83.06,21.59 84.84,19.81 RJ1.P4
TD+  (via drill 0.3)
  Top 0.305: v89.15,30.73 89.15,32.26 RN4.2 | v84.84,51.56 IC6.17
  Bottom 0.305: RJ1.TD+ 87.38,16 86.11,17.27 86.11,20.07 85.34,20.83 84.58,20.83 83.57,21.84 83.57,25.15 v89.15,30.73 89.15,35.31 84.07,40.39 84.07,41.66 84.84,42.42 v84.84,51.56
TD-  (via drill 0.3)
  Top 0.305: v82.3,26.16 88.39,32.26 RN4.1 | v86.11,51.82 IC6.16
  Bottom 0.305: RJ1.TD- 84.84,17.27 82.3,19.81 v82.3,26.16 82.55,26.42 82.55,29.46 85.6,32.51 85.6,38.1 83.57,40.13 83.57,51.31 84.58,52.32 85.09,52.32 85.6,51.82 v86.11,51.82
VCC  (via drill 0.3)
  Top 0.305: RUSB.2 36.83,42.67 39.62,42.67 IC7.8 39.88,42.67 39.88,41.66 41.15,40.39 44.96,40.39 46.48,41.91 IC5.16 46.74,42.16 46.74,44.7 50.29,48.26 | 50.55,48.51 49.53,49.53 46.99,49.53 IC4.18 46.74,49.53 46.23,49.53 45.47,50.29 39.62,50.29 | 39.62,50.29 38.61,50.29 IC4.6 | 50.55,48.51 50.29,48.26 | 50.55,48.51 ROE.2 50.29,48.26 | 54.1,43.43 54.1,44.45 50.29,48.26 | 54.1,43.43 54.1,42.16 IC5.10 | 35.31,56.39 35.31,53.59 C4.1 35.56,53.59 37.08,52.07 38.35,52.07 IC4.4 38.61,52.07 v39.62,52.07 | v26.42,57.15 12.45,57.15 IC8.VDD | 35.31,56.39 v33.78,56.39 | 35.31,56.39 RRST.1 | v39.62,50.55 39.62,50.29 | IC6.28 70.87,53.85 71.63,54.61 73.91,54.61 74.68,53.85 IC6.25 74.68,53.09 75.18,52.58 75.18,52.32 75.44,52.07 75.69,52.07 | 81.03,53.34 86.36,58.67 86.36,59.44 RN1.1 | 81.03,53.34 81.79,53.34 | 81.79,53.34 82.3,53.34 IC6.19 | 81.03,53.34 IC6.20 | IC6.15 87.38,52.07 86.11,50.8 84.33,50.8 83.06,52.07 | 81.79,53.34 83.06,52.07 | 83.06,52.07 75.69,52.07 | IC2.2 16,17.27 16,13.97 C3.+ 17.27,12.7 EXTIN.1 21.08,11.43 30.73,1.78 67.82,1.78 72.64,6.6 EXTOUT.1 | v83.82,37.59 87.88,37.59 L2.2 | 71.63,24.89 71.63,30.99 75.44,34.8 75.44,38.1 IC9.8 | JP1.3 71.63,24.89 | v75.69,51.05 75.69,52.07 | 54.1,43.43 55.88,43.43 68.07,31.24 68.07,23.37 69.6,21.84 75.44,21.84 76.71,23.11 76.71,24.13 75.95,24.89 71.63,24.89
  Bottom 0.305: v26.42,57.15 33.02,57.15 v33.78,56.39 | v39.62,52.07 v39.62,50.55 | v83.82,37.59 81.79,35.56 80.01,35.56 | 80.01,35.56 77.72,35.56 75.69,33.53 75.69,28.19 74.17,26.67 74.17,24.89 73.91,24.64 | JP1.3 73.91,24.64 | EXTOUT.1 72.64,13.46 73.91,14.73 73.91,24.64 | v75.69,51.05 75.69,48.01 80.01,43.69 80.01,35.56
VIN  (via drill 0.3)
  Top 0.305: RDA.1 65.28,60.71 62.23,60.71 RCL.1 62.23,60.45 60.45,60.45 58.42,58.42 | 58.42,58.42 58.42,57.4 60.2,55.63 IC3.8 60.45,55.37 v60.45,53.09 | 58.42,58.42 53.59,63.25 53.09,63.25 LCD.15 | 58.42,58.42 C6.1 | IC2.3 20.57,18.29 C2.+ | v29.97,30.23 RT.1 | v60.96,46.99 60.96,39.88 69.09,31.75 69.09,24.89 JP1.1
  Bottom 0.305: USB.VBUS 12.95,26.16 17.78,30.99 17.78,37.34 L1.2 17.78,37.59 17.78,39.12 | 11.43,54.86 10.41,53.85 4.32,53.85 ISP.2 | 11.43,54.86 19.81,63.25 LCD.2 | 17.78,39.12 17.78,40.89 11.43,47.24 11.43,54.86 | C2.+ 29.97,27.69 v29.97,30.23 33.02,30.23 38.86,36.07 | JP1.1 68.07,23.62 56.39,35.31 56.39,38.86 54.61,40.64 43.43,40.64 38.86,36.07 | v60.45,53.09 60.45,47.5 v60.96,46.99 | 17.78,39.12 35.81,39.12 38.86,36.07

### Text on the board
tNames: OpenSprinkler (v1.4s) | Rayshobby, July 2012 | 100 | 2.32k | 18 | EXT | INT | MEGA328 | D2 | RFM12B | D10 | SM4001 | 1 | 2.32k | 1.5k | 10k | 30k | SS14 | 47 | 49.9x4 | 220 | 330 | A2 A3 SDA SCL GND | 100u | USB | +5V VCC A6 A7 GND | RJ45 | DIN CLK LAT !OE | DOUT CLK LAT !OE | AC IN | VCC GND GND GND | VCC GND GND GND | EXTIN | EXTOUT | 1 | 2 | 3 | 4 | 5 | 6 | 7 | 8 | RainSense
BoxDim: Serpac WM-032C Enclosure | All units are in inch | Left | Right | Front | Bottom